# Altium project switchcard_powered.PrjPcb
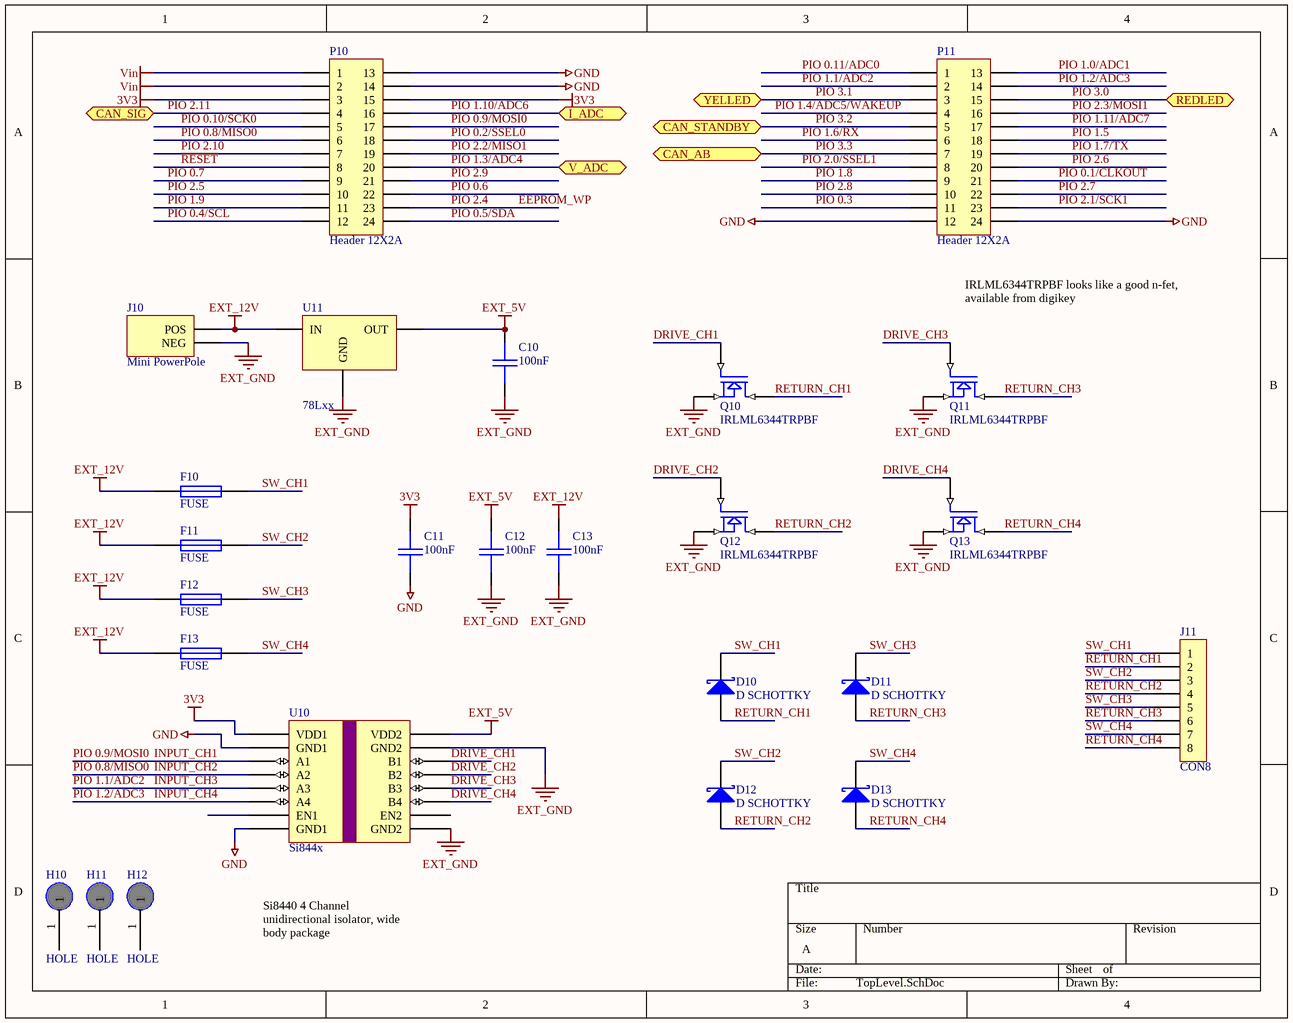
[diagram p0: TopLevel.SchDoc]
1 sheet, 25 parts. Net scope: flat (ports and power ports of the same name join across sheets).
Board file: switchcard_powered.PcbDoc

## Sheet TopLevel.SchDoc
size A

### Parts
C10  100nF  [0603]
C11  100nF  [0603]
C12  100nF  [0603]
C13  100nF  [0603]
D10  D SCHOTTKY  [SMB]
D11  D SCHOTTKY  [SMB]
D12  D SCHOTTKY  [SMB]
D13  D SCHOTTKY  [SMB]
F10  FUSE  [LITTELFUSE-154]
F11  FUSE  [LITTELFUSE-154]
F12  FUSE  [LITTELFUSE-154]
F13  FUSE  [LITTELFUSE-154]
H10  HOLE  [M2.5]
H11  HOLE  [M2.5]
H12  HOLE  [M2.5]
J10  Mini PowerPole  [POWERPOLE25A-2]
J11  CON8  [JST_SolderHoles]
P10  Header 12X2A  [HDR2X12_CEN]
P11  Header 12X2A  [HDR2X12_CEN]
Q10  IRLML6344TRPBF  [SOT23-3]
Q11  IRLML6344TRPBF  [SOT23-3]
Q12  IRLML6344TRPBF  [SOT23-3]
Q13  IRLML6344TRPBF  [SOT23-3]
U10  Si844x  [SO16 (Wide)]
U11  78Lxx  [78Lxx SO8]

### Ports
CAN_AB, CAN_SIG, CAN_STANDBY, I_ADC, REDLED (bidir), V_ADC, YELLED (bidir)

### Nets
3V3: C11.1 P10.3 P10.15 U10.1(VDD1)
EXT_5V: C10.1 C12.1 U10.16(VDD2) U11.OUTPUT(OUT)
EXT_12V: C13.1 F10.1 F11.1 F12.1 F13.1 J10.POS U11.INPUT(IN)
EXT_GND: C10.2 C12.2 C13.2 J10.NEG Q10.2(S) Q11.2(S) Q12.2(S) Q13.2(S) U10.9(GND2) U10.15(GND2) U11.COMMON(GND)
GND: C11.2 P10.13 P10.14 P11.12 P11.24 U10.2(GND1) U10.8(GND1)
Vin: P10.1 P10.2
DRIVE_CH1: Q10.1(G) U10.14(B1)
DRIVE_CH2: Q12.1(G) U10.13(B2)
DRIVE_CH3: Q11.1(G) U10.12(B3)
DRIVE_CH4: Q13.1(G) U10.11(B4)
EEPROM_WP: P10.23  [also labelled PIO 2.4]
INPUT_CH1: P10.17 U10.3(A1)  [also labelled PIO 0.9/MOSI0]
INPUT_CH2: P10.6 U10.4(A2)  [also labelled PIO 0.8/MISO0]
INPUT_CH3: P11.2 U10.5(A3)  [also labelled PIO 1.1/ADC2]
INPUT_CH4: P11.14 U10.6(A4)  [also labelled PIO 1.2/ADC3]
PIO 0.1/CLKOUT: P11.21
PIO 0.2/SSEL0: P10.18
PIO 0.3: P11.11
PIO 0.4/SCL: P10.12
PIO 0.5/SDA: P10.24
PIO 0.6: P10.22
PIO 0.7: P10.9
PIO 0.10/SCK0: P10.5
PIO 0.11/ADC0: P11.1
PIO 1.0/ADC1: P11.13
PIO 1.3/ADC4: P10.20 ; port V_ADC
PIO 1.4/ADC5/WAKEUP: P11.4
PIO 1.5: P11.18
PIO 1.6/RX: P11.6
PIO 1.7/TX: P11.19
PIO 1.8: P11.9
PIO 1.9: P10.11
PIO 1.10/ADC6: P10.16 ; port I_ADC
PIO 1.11/ADC7: P11.17
PIO 2.0/SSEL1: P11.8
PIO 2.1/SCK1: P11.23
PIO 2.2/MISO1: P10.19
PIO 2.3/MOSI1: P11.16
PIO 2.5: P10.10
PIO 2.6: P11.20
PIO 2.7: P11.22
PIO 2.8: P11.10
PIO 2.9: P10.21
PIO 2.10: P10.7
PIO 2.11: P10.4 ; port CAN_SIG
PIO 3.0: P11.15 ; port REDLED
PIO 3.1: P11.3 ; port YELLED
PIO 3.2: P11.5 ; port CAN_STANDBY
PIO 3.3: P11.7 ; port CAN_AB
~{RESET}: P10.8
RETURN_CH1: D10.A J11.2 Q10.3(D)
RETURN_CH2: D12.A J11.4 Q12.3(D)
RETURN_CH3: D11.A J11.6 Q11.3(D)
RETURN_CH4: D13.A J11.8 Q13.3(D)
SW_CH1: D10.K F10.2 J11.1
SW_CH2: D12.K F11.2 J11.3
SW_CH3: D11.K F12.2 J11.5
SW_CH4: D13.K F13.2 J11.7

Not connected (* = marked no-connect by the designer): H10 1; H11 1; H12 1; U10 7(EN1) 10(EN2)

### Notes on the sheet
- IRLML6344TRPBF looks like a good n-fet, available from digikey
- Si8440 4 Channel unidirectional isolator, wide body package

### Library data of the parts
C10-C13 = CAP: Capacitor
D10-D13 = D SCHOTTKY: Schottky Diode; Manufacturer: Generic Components; Class I: Discrete; Class II: Diode - Schottky; Published: 8-Jun-2000; Revision: July-2002: Re-released for DXP Platform.; Publisher: Altium Limited
H10-H12 = HOLE: Needed?: NO - Footprint
J10 = PowerPole
J11 = CON8: 8 Pin 3.5mm Screw Terminal  header; Farnell: 617-507; Farnell - Opposite: 617-404 or 155-408
P10 P11 = Header 12X2A: Header, 12-Pin, Dual row; LatestRevisionDate: 17-Jul-2002; LatestRevisionNote: Re-released for DXP Platform.; Publisher: Altium Limited
Q10-Q13 = ZXM61N02F: 5A, 30V N-Channel Enhancement mode FET
U10 = Si844x: Si844x High Speed Digital Isolator
U11 = 78Lxx SOIC LDO